# Altium schematic sheet rtc.SchDoc
size A4
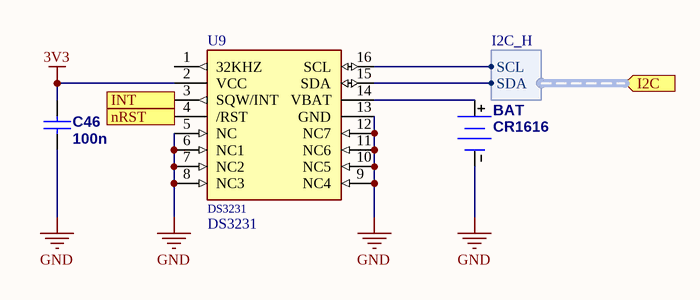
[diagram p0: rtc.SchDoc]

## Parts
BAT  CR1616  [KEYSTONE_3016]
C46  100n  [C0603]
U9  DS3231  [SO16W]

## Ports
I2C (in, harness I2C_H), INT (out), nRST (out)

## Harnesses
I2C_H: SCL, SDA

## Nets
3V3: C46.2 U9.2(VCC)
GND: BAT.2(-) C46.1 U9.5(NC) U9.6(NC1) U9.7(NC2) U9.8(NC3) U9.9(NC4) U9.10(NC5) U9.11(NC6) U9.12(NC7) U9.13(GND)
INT: U9.3(SQW/INT) ; port INT
nRST: U9.4(/RST) ; port nRST
NetBAT_1: BAT.1(+) U9.14(VBAT)
NetU9_15: U9.15(SDA) ; port I2C.SDA
NetU9_16: U9.16(SCL) ; port I2C.SCL

Not connected (* = marked no-connect by the designer): U9 1(32KHZ)

## Library data of the parts
BAT = CR1616 Battery: Published: 24-Mar-1999; Revision: July-2002: Re-released for DXP Platform.; Publisher: Altium Limited
C46 = Cap: Capacitor; ComponentLink1Description: datasheet; ComponentLink2Description: supplier; Value: 100n
U9 = DS3231: å®žæ—¶æ—¶é’Ÿï¼ˆRTCï¼‰ICæ—¶é’Ÿ/æ—¥åŽ†IÂ²Cï¼Œ2çº¿ä¸²è¡Œ16-SOICï¼ˆ0.295â€œï¼Œ7.50mmå®½åº¦ï¼‰; MF: Maxim Integrated; Value: *; MP: DS3231; Package: SOIC-16 Maxim Integrated; Price: None; SnapEDA_Link: https://www.snapeda.com/parts/DS3231/Maxim%20Integrated/view-part/553791/?ref=snap; Availability: Unavailable